# EAGLE design Radio_UFOP_revA (EAGLE 8.5.0)
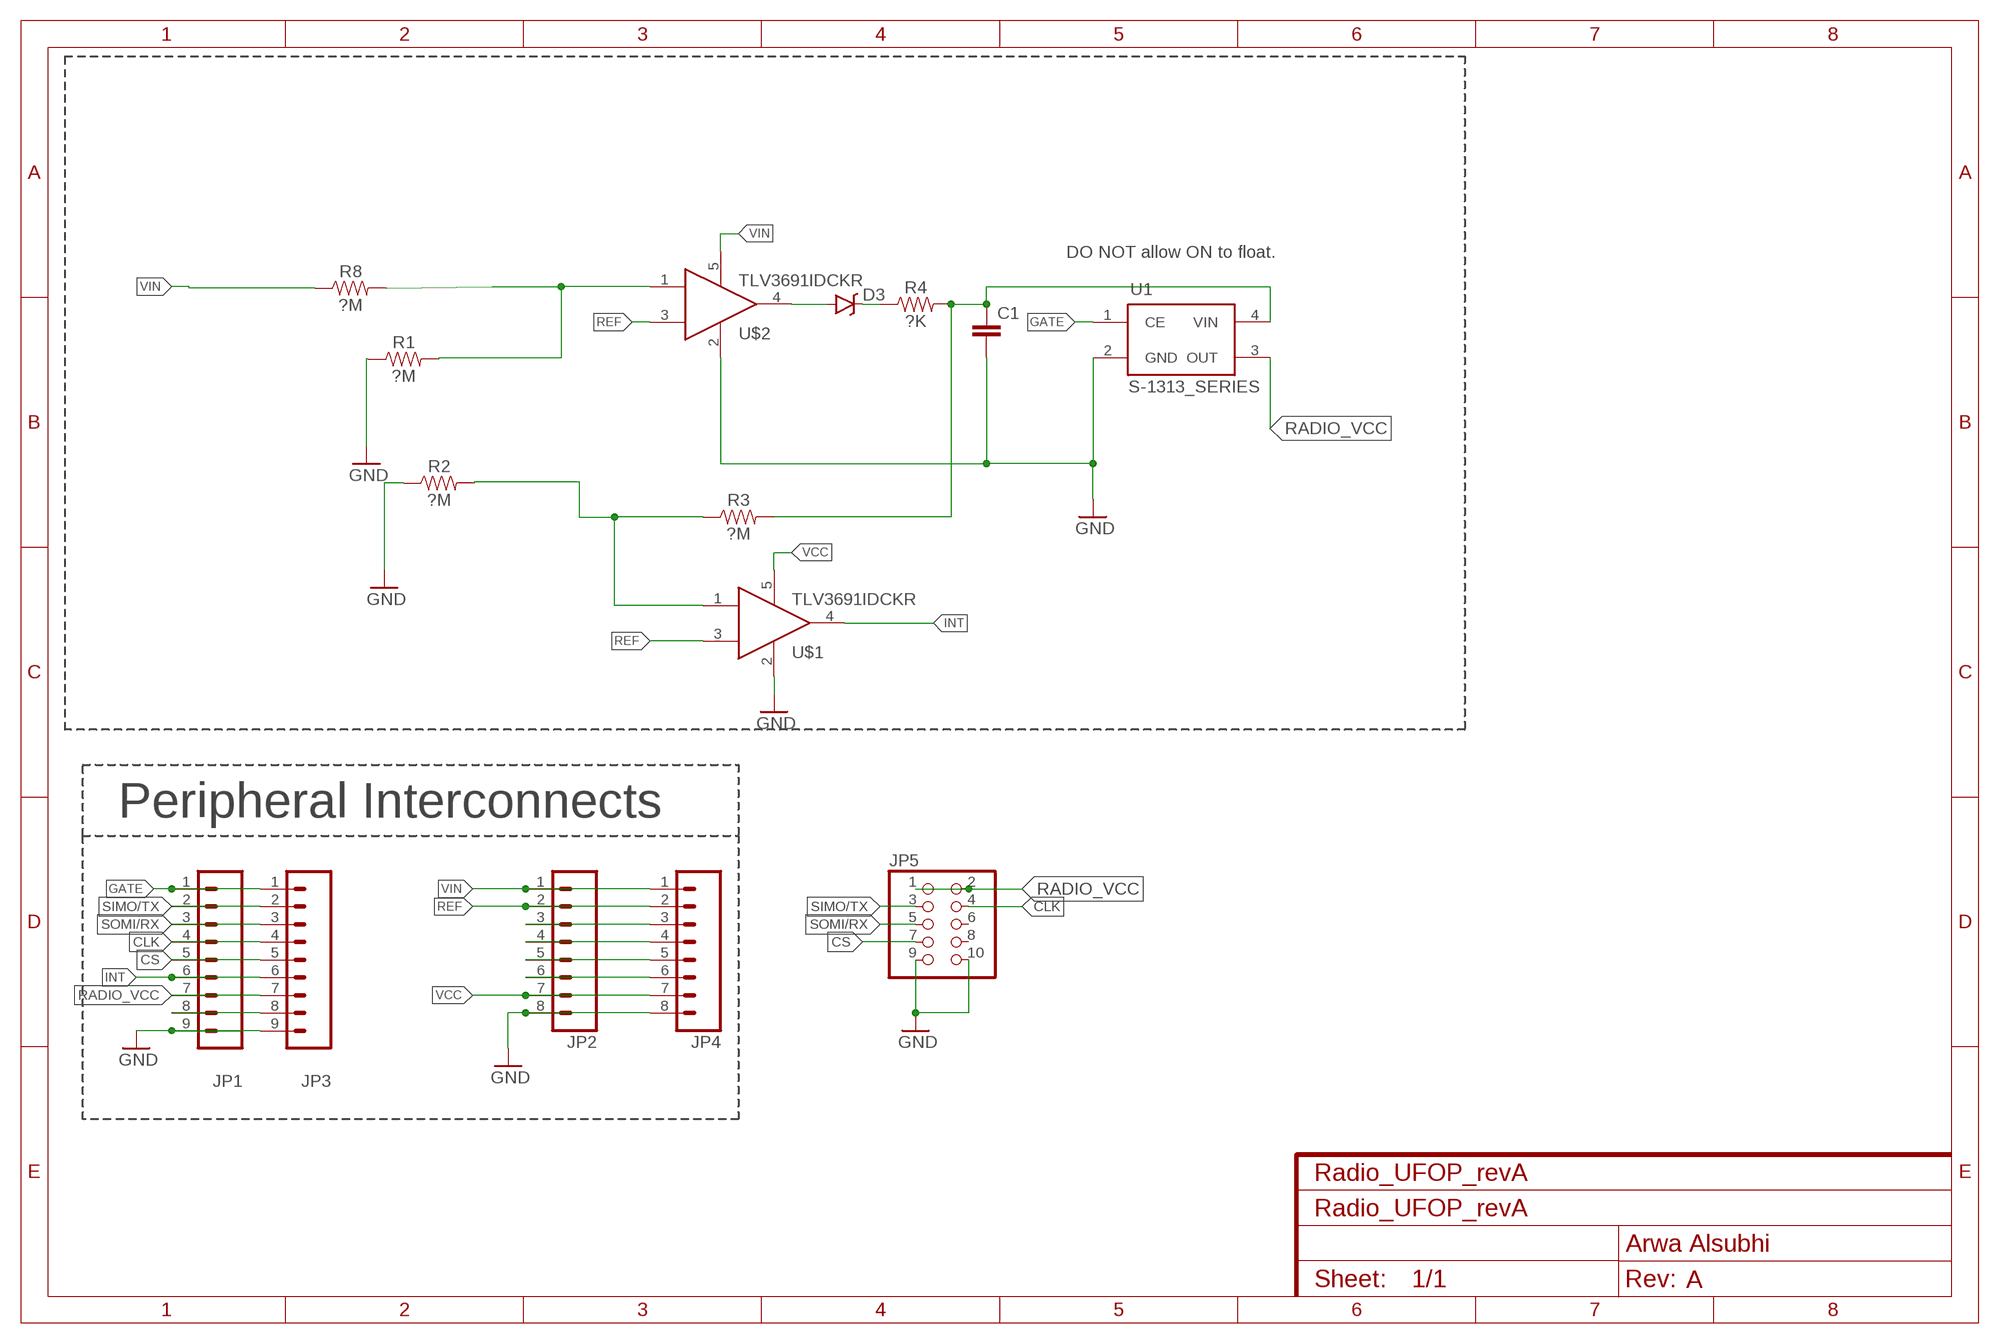
[diagram p0: schematic, sheet 1]
FRAME2 (FRAME-A4L): CNAME: Radio_UFOP_revA; CREVISION: A; DESIGNER: Arwa Alsubhi

## Parts
C1  CAP0603-CAP  [0603-CAP]
D3  RB751  DIODE-SCHOTTKY-RB751  [SOD-523]
JP1  M091.27MM  [1X09-1.27MM]
JP2  M081.27MM  [1X08-1.27MM]
JP3  M091.27MM  [1X09-1.27MM]
JP4  M081.27MM  [1X08-1.27MM]
JP5  PINHD-2X5  [2X05]
R1  ?M  0.3OHM-0805-1/8W-1%  [0805]
R2  ?M  0.3OHM-0805-1/8W-1%  [0805]
R3  ?M  0.3OHM-0805-1/8W-1%  [0805]
R4  ?K  0.3OHM-0805-1/8W-1%  [0805]
R8  ?M  0.3OHM-0805-1/8W-1%  [0805]
U1  S-1313_SERIES  [SC82-AB_1PRIMARY]
U$1  TLV3691IDCKR  [SOT353]
U$2  TLV3691IDCKR  [SOT353]

## Nets
CLK: JP1.4 JP3.4 JP5.4
CS: JP1.5 JP3.5 JP5.7
GATE: JP1.1 JP3.1 U1.1(CE)
GND: C1.2 JP1.9 JP2.8 JP3.9 JP4.8 JP5.9 JP5.10 R1.1 R2.1 U1.2(GND) U$1.2 U$2.2
INT: JP1.6 JP3.6 U$1.4
N$1: D3.A U$2.4
N$4: R1.2 R8.2 U$2.1
N$5: R2.2 R3.1 U$1.1
N$9: D3.C R4.1
N$10: JP1.8 JP3.8
N$11: JP2.6 JP4.6
N$12: JP2.5 JP4.5
N$13: JP2.4 JP4.4
N$14: JP2.3 JP4.3
N$20: C1.1 R3.2 R4.2 U1.4(VIN)
RADIO_VCC: JP1.7 JP3.7 JP5.1 JP5.2 U1.3(OUT)
REF: JP2.2 JP4.2 U$1.3 U$2.3
SIMO/TX: JP1.2 JP3.2 JP5.3
SOMI/RX: JP1.3 JP3.3 JP5.5
VCC: JP2.7 JP4.7 U$1.5
VIN: JP2.1 JP4.1 R8.1 U$2.5
Unconnected: JP5.6 JP5.8

## Notes on the sheet
- DO NOT allow ON to float.
- Peripheral Interconnects

## Library data of the parts
C1 = SparkFun-Capacitors:CAP: Capacitor Standard 0603 ceramic capacitor, and 0.1" leaded capacitor.
D3 = SparkFun-DiscreteSemi:DIODE-SCHOTTKY: Schottky diodes in SFE's production catalog BAT20J 1A 23V 0.62Vf RB751 120mA 40V 0.37Vf PMEG4005EJ 0.5A 40V 0.42Vf MBRA140 1A 40V 0.5Vf B340A 3A 40V SMA; DIGIKEY: BAS40-02V-V-G-08GICT-ND; MPN: BAS40-02V-V-G-08; PROD_ID: DIO-11018
JP1 JP3 = SparkFun-Connectors:M09: Header 9 Standard 9-pin 0.1" header. Use with straight break away headers (SKU : PRT-00116), right angle break away headers (PRT-00553), swiss pins (PRT-00743), machine pins (PRT-00117), and female headers (PRT-00115).; DIGIKEY: S9014E-09-ND; MANUFACTURERPARTNUMBER: GRPB091VWVN-RC; MPN: GRPB091VWVN-RC
JP2 JP4 = SparkFun-Connectors:M08: Header 8 Standard 8-pin 0.1" header. Use with straight break away headers (SKU : PRT-00116), right angle break away headers (PRT-00553), swiss pins (PRT-00743), machine pins (PRT-00117), and female headers (PRT-00115).; DIGIKEY: S9014E-08-ND; MANUFACTURERPARTNUMBER: GRPB081VWVN-RC; MPN: GRPB081VWVN-RC
JP5 = pinhead:PINHD-2X5: PIN HEADER
R1-R4 R8 = SparkFun-Resistors:0.3OHM: 0.3Ω resistor A resistor is a passive two-terminal electrical component that implements electrical resistance as a circuit element. Resistors act to reduce current flow, and, at the same time, act to lower voltage levels within circuits. - Wikipedia; PROD_ID: RES-11622; VALUE: 0.3
U1 = Arwa_lib:S-1313_SERIES: S-1313 Series-Current consumption is as low as 0.9 uA typ The S-1313 Series, developed by using the CMOS technology, is a positive voltage regulator IC which has the super low current consumption and the low dropout voltage. Current consumption is as low as 0.9 uA typ., and a ceramic capacitor of 0.1 F or more can be used as the input and output capacitors..
U$1 U$2 = Arwa_lib:TLV3691IDCKR

## Board
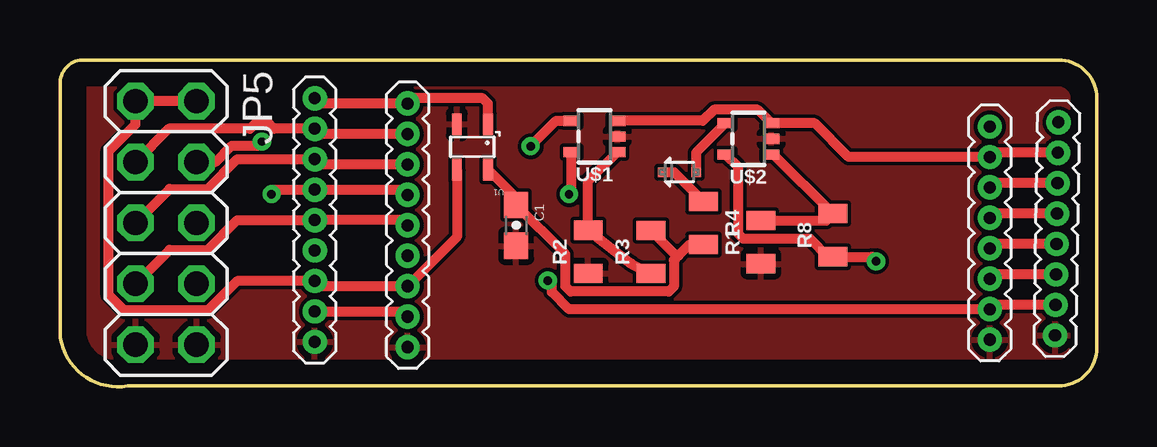
[diagram p1: board, top side]
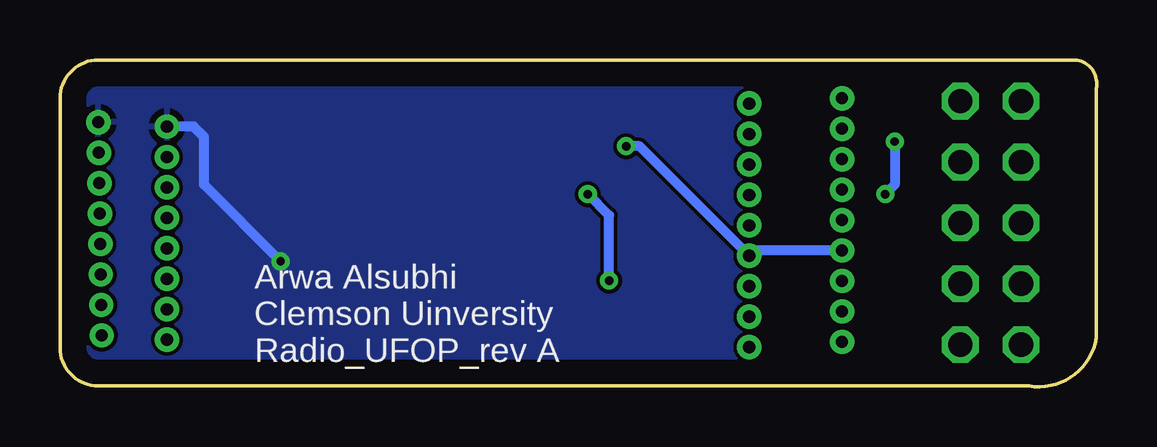
[diagram p2: board, bottom side, seen from below]

Size 43.22 x 13.63 mm. Coordinates in mm from the lower left corner, seen from the top.
Outline: 7.62,0.03 8.82,0.03
Outline: 8.82,0.03 2.82,0.03 arc-90 0.02,2.03 0.02,12.43 arc-90 0.82,13.63 41.62,13.63 arc-90 43.22,12.03 43.22,1.63 arc-90 41.62,0.03 8.82,0.03
Copper layers (1*16): Top 0.035mm / dielectric 1.5mm / Bottom 0.035mm
Design rules "default": minimum track width 6mil, minimum drill 0.35mm, track to track 6mil, track to pad 6mil, pad to pad 6mil, via to via 6mil, smd to smd 6mil, copper to edge 40mil, drill to drill 6mil, minimum pad ring 10mil, minimum via ring 8mil, stop-mask expansion 4mil, vias tented up to drill 0mil, thermal gap 10mil

### Footprints (pad centres in the part's own frame; a part is rotated, then mirrored left to right if it is on the bottom)
0603-CAP = smd 1.1 x 1: 1 -0.85,0; 2 0.85,0
SOD-523 = smd 0.4 x 0.4: A -0.7,0; C 0.7,0
1X09-1.27MM = drill 0.508 pad 1: 1 0,0; 2 1.27,0; 3 2.54,0; 4 3.81,0; 5 5.08,0; 6 6.35,0; 7 7.62,0; 8 8.89,0; 9 10.16,0
1X08-1.27MM = drill 0.508 pad 1: 1 0,0; 2 1.27,0; 3 2.54,0; 4 3.81,0; 5 5.08,0; 6 6.35,0; 7 7.62,0; 8 8.89,0
2X05 = drill 1.016 octagon: 1 -5.08,-1.27; 2 -5.08,1.27; 3 -2.54,-1.27; 4 -2.54,1.27; 5 0,-1.27; 6 0,1.27; 7 2.54,-1.27; 8 2.54,1.27; 9 5.08,-1.27; 10 5.08,1.27
0805 = smd 0.8 x 1.2: 1 -0.9,0; 2 0.9,0
SC82-AB_1PRIMARY = smd 0.406 x 0.914: 1 -0.621,-0.913; 2 0.675,-0.913; 3 0.675,0.967; 4 -0.621,0.967
SOT353 = smd 0.42 x 0.7: 1 -0.65,-0.95; 2 0,-0.95; 3 0.65,-0.95; 4 0.65,0.95; 5 -0.65,0.95

### Placement (x,y rotation side)
C1  19.02,6.73 270 top
D3  25.82,8.95 180 top
JP1  14.49,11.81 270 top
JP2  38.76,10.85 270 top
JP3  10.62,12.03 270 top
JP4  41.62,11.03 269.1 top
JP5  4.42,6.83 270 top
R1  29.22,6.03 90 top
R2  22.02,5.63 90 top
R3  24.63,5.62 90 top
R4  26.82,6.83 270 top
R8  32.22,6.32 90 top
U1  17.22,10.03 180 top
U$1  22.28,10.44 90 top
U$2  28.7,10.34 90 top

### Tracks (layer width: path | path; a pad name or v marks a point on that pad's centre or on a via)
CLK  (via drill 0.35)
  Top 0.406: JP5.4 6.48,9.37 7.16,10.05 8.24,10.05 v8.42,10.23 | v8.82,8.03 9.01,8.22 JP3.4 14.27,8.22 JP1.4
  Bottom 0.406: v8.42,10.23 8.42,8.43 v8.82,8.03
CS
  Top 0.406: JP5.7 4.57,5.71 6.15,5.71 7.39,6.95 JP3.5 14.27,6.95 JP1.5
GATE
  Top 0.406: U1.1 17.84,11.81 17.62,12.03 14.71,12.03 JP1.1 10.84,11.81 JP3.1
GND
  pour Top: 0.02,14.33 43.22,14.33 43.22,-0.47 0.02,-0.47
INT  (via drill 0.35)
  Top 0.406: v19.62,10.03 20.68,11.09 U$1.4
  Bottom 0.406: JP3.6 14.27,5.68 JP1.6 19.06,10.03 v19.62,10.03
N$1
  Top 0.406: U$2.4 26.52,9.76 D3.A
N$4
  Top 0.406: U$2.1 29.75,9.69 R8.2 31.93,6.93 R1.2
N$5
  Top 0.406: U$1.1 22.02,8.58 R2.2 23.83,5.12 R3.1
N$9
  Top 0.406: R4.1 25.6,8.95 D3.C
N$10
  Top 0.406: JP3.8 14.27,3.14 JP1.8
N$11
  Top 0.406: JP4.6 38.94,4.68 JP2.6
N$12
  Top 0.406: JP4.5 38.94,5.95 JP2.5
N$13
  Top 0.406: JP4.4 38.94,7.22 JP2.4
N$14
  Top 0.406: JP4.3 38.94,8.49 JP2.3
N$20
  Top 0.406: R4.2 26.25,5.93 25.78,5.47 | 25.78,5.47 25.59,5.27 25.59,4.18 25.38,3.97 21.28,3.97 21.06,4.19 21.06,5.54 C1.1 19.02,7.89 U1.4 | R3.2 25.68,5.47 25.78,5.47
RADIO_VCC
  Top 0.406: JP5.2 JP5.1 3.15,10.95 2.03,9.84 2.03,3.83 2.69,3.17 6.15,3.17 7.39,4.41 JP3.7 10.84,4.19 JP1.7 16.54,6.25 U1.3
REF
  Top 0.406: JP4.2 38.94,9.76 JP2.2 32.87,9.58 31.46,10.99 U$2.3 29.08,11.56 27.25,11.56 26.79,11.09 U$1.3
SIMO/TX
  Top 0.406: JP1.2 10.84,10.54 JP3.2 8.92,10.76 8.72,10.96 8.12,10.96 7.92,10.76 4.54,10.76 JP5.3
SOMI/RX
  Top 0.406: JP5.5 4.57,8.25 6.15,8.25 7.39,9.49 JP3.3 10.84,9.27 JP1.3
VCC  (via drill 0.35)
  Top 0.406: JP4.7 38.94,3.41 JP2.7 21.23,3.23 20.51,3.95 20.51,4.26 v20.33,4.43 | v21.22,8.03 21.33,8.14 U$1.5
  Bottom 0.406: v20.33,4.43 20.33,7.14 v21.22,8.03
VIN  (via drill 0.35)
  Top 0.406: U$2.5 28.26,9.18 28.26,6.39 28.47,6.18 31.27,6.18 32.02,5.42 R8.1 33.83,5.42 v34.02,5.23
  Bottom 0.406: v34.02,5.23 37.22,8.43 37.22,10.43 37.64,10.85 JP2.1
  pour Bottom: 0.02,14.33 43.22,14.33 43.22,-0.37 0.02,-0.37

### Text on the board
bNames: Arwa Alsubhi / Clemson Uinversity / Radio_UFOP_rev A